# EAGLE schematic fsr_endstop_small (EAGLE 6.5.0)
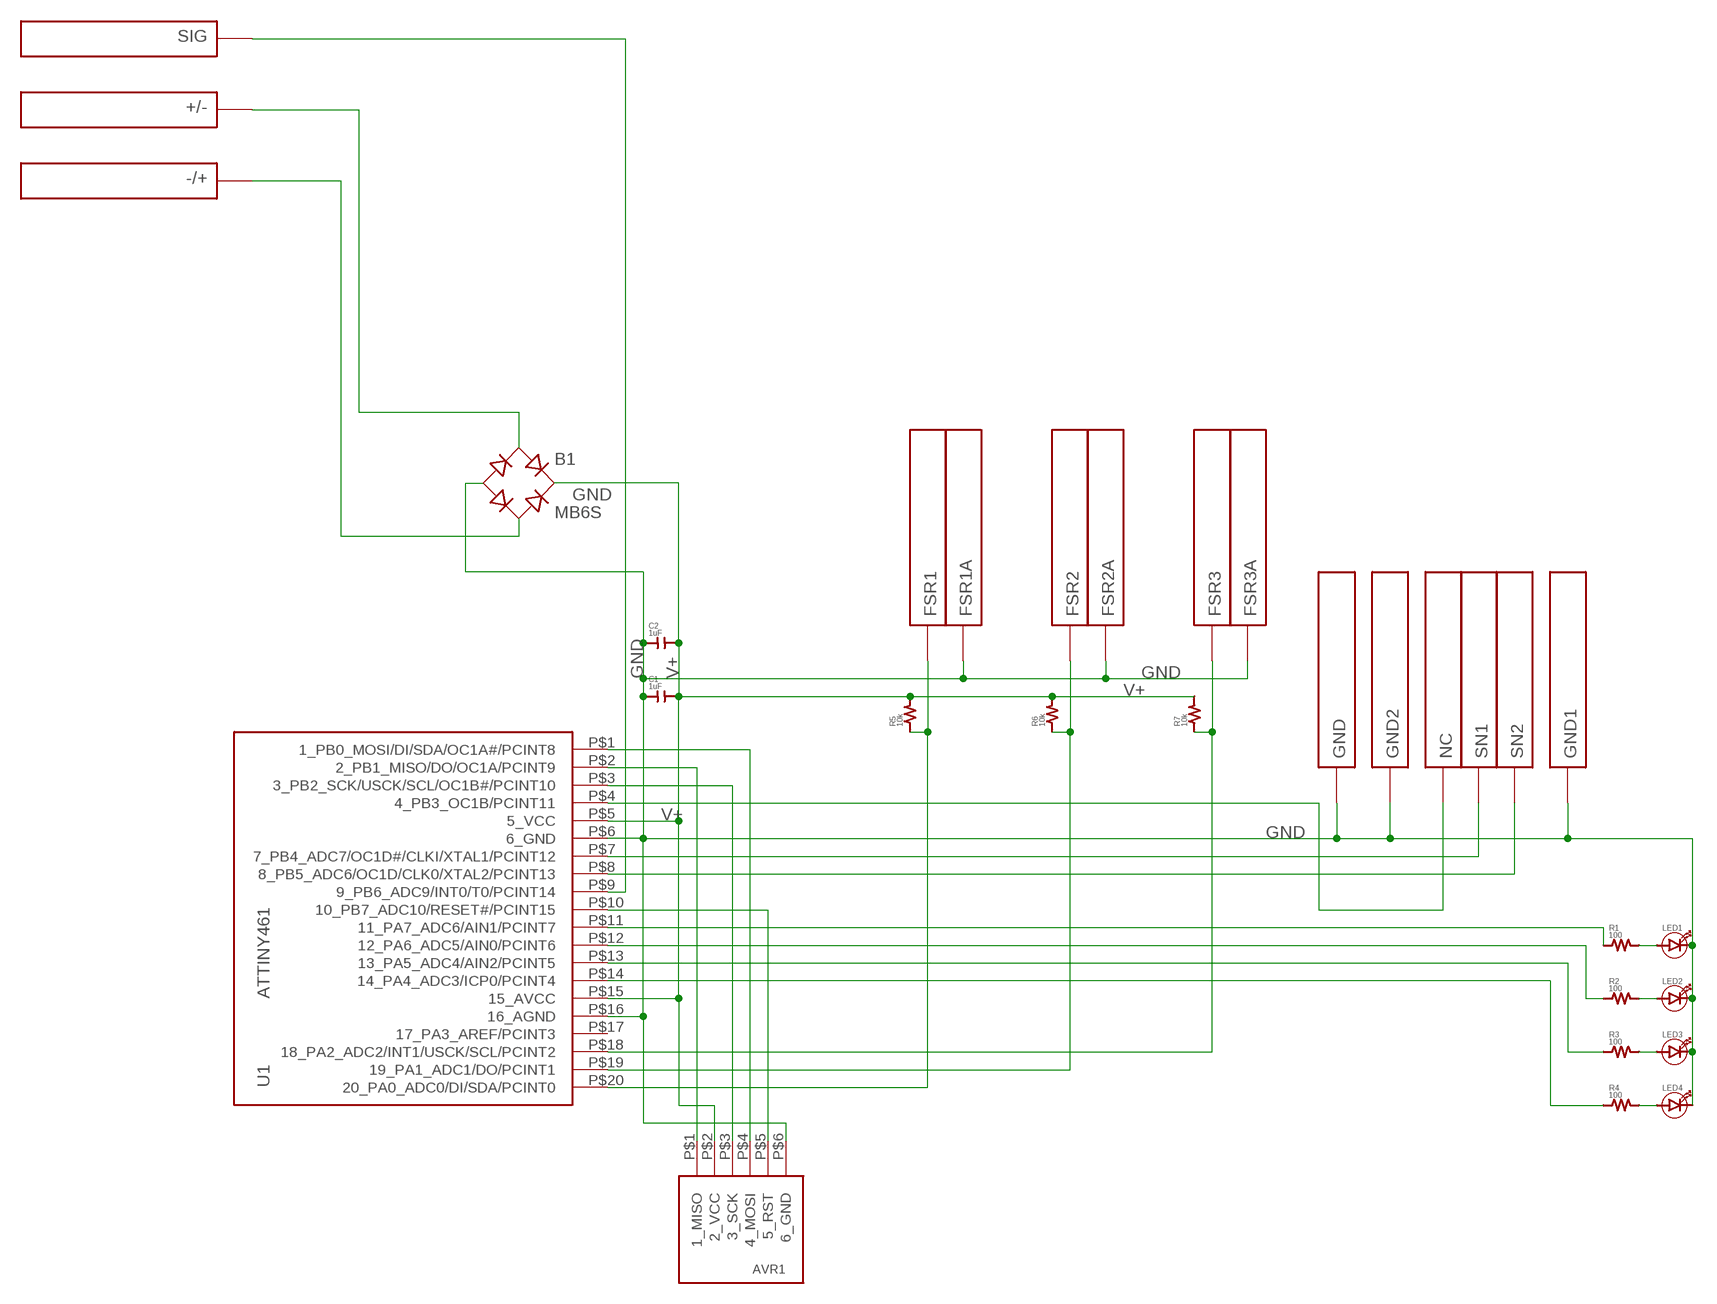
[diagram p0: schematic, sheet 1]

## Parts
+/-  PIN1.2MM  [PIN_1.2MM]
-/+  PIN1.2MM  [PIN_1.2MM]
AVR1  AVR6  [AVR6]
B1  MB6S  [SOIC-4]
C1  1uF  CAP0603  [0603]
C2  1uF  CAP0603  [0603]
FSR1  PIN1.2MM  [PIN_1.2MM]
FSR1A  PIN1.2MM  [PIN_1.2MM]
FSR2  PIN1.2MM  [PIN_1.2MM]
FSR2A  PIN1.2MM  [PIN_1.2MM]
FSR3  PIN1.2MM  [PIN_1.2MM]
FSR3A  PIN1.2MM  [PIN_1.2MM]
GND  PIN1.2MM  [PIN_1.2MM]
GND1  PIN1.2MM  [PIN_1.2MM]
GND2  PIN1.2MM  [PIN_1.2MM]
LED1  LED0603  [0603_DIODE]
LED2  LED0603  [0603_DIODE]
LED3  LED0603  [0603_DIODE]
LED4  LED0603  [0603_DIODE]
NC  PIN1.2MM  [PIN_1.2MM]
R1  100  RES0603  [0603]
R2  100  RES0603  [0603]
R3  100  RES0603  [0603]
R4  100  RES0603  [0603]
R5  10k  RES0603  [0603]
R6  10k  RES0603  [0603]
R7  10k  RES0603  [0603]
SIG  PIN1.2MM  [PIN_1.2MM]
SN1  PIN1.2MM  [PIN_1.2MM]
SN2  PIN1.2MM  [PIN_1.2MM]
U1  ATTINY461  [SOIC-20]

## Nets
GND: AVR1.P$6(6_GND) B1.- C1.1 C2.1 FSR1A.P$1 FSR2A.P$1 FSR3A.P$1 GND1.P$1 GND2.P$1 GND.P$1 LED1.- LED2.- LED3.- LED4.- U1.P$6(6_GND) U1.P$16(16_AGND)
N$1: AVR1.P$4(4_MOSI) U1.P$1(1_PB0_MOSI/DI/SDA/OC1A#/PCINT8)
N$2: AVR1.P$1(1_MISO) U1.P$2(2_PB1_MISO/DO/OC1A/PCINT9)
N$3: -/+.P$1 B1.~2(AC2)
N$4: +/-.P$1 B1.~1(AC1)
N$5: AVR1.P$3(3_SCK) U1.P$3(3_PB2_SCK/USCK/SCL/OC1B#/PCINT10)
N$6: AVR1.P$5(5_RST) U1.P$10(10_PB7_ADC10/RESET#/PCINT15)
N$7: FSR1.P$1 R5.1 U1.P$20(20_PA0_ADC0/DI/SDA/PCINT0)
N$8: FSR2.P$1 R6.1 U1.P$19(19_PA1_ADC1/DO/PCINT1)
N$9: FSR3.P$1 R7.1 U1.P$18(18_PA2_ADC2/INT1/USCK/SCL/PCINT2)
N$10: R4.1 U1.P$14(14_PA4_ADC3/ICP0/PCINT4)
N$11: R3.1 U1.P$13(13_PA5_ADC4/AIN2/PCINT5)
N$12: R2.1 U1.P$12(12_PA6_ADC5/AIN0/PCINT6)
N$13: R1.1 U1.P$11(11_PA7_ADC6/AIN1/PCINT7)
N$14: SIG.P$1 U1.P$9(9_PB6_ADC9/INT0/T0/PCINT14)
N$15: NC.P$1 U1.P$4(4_PB3_OC1B/PCINT11)
N$16: SN2.P$1 U1.P$8(8_PB5_ADC6/OC1D/CLK0/XTAL2/PCINT13)
N$17: SN1.P$1 U1.P$7(7_PB4_ADC7/OC1D#/CLKI/XTAL1/PCINT12)
N$18: LED1.+ R1.2
N$19: LED2.+ R2.2
N$20: LED3.+ R3.2
N$21: LED4.+ R4.2
V+: AVR1.P$2(2_VCC) B1.+ C1.2 C2.2 R5.2 R6.2 R7.2 U1.P$5(5_VCC) U1.P$15(15_AVCC)
Unconnected: U1.P$17(17_PA3_AREF/PCINT3)

## Library data of the parts
+/- -/+ FSR1 FSR1A FSR2 FSR2A FSR3 FSR3A GND GND1 GND2 NC SIG SN1 SN2 = _sg_lib:PIN
AVR1 = _sg_misc:AVR6
B1 = rectifier:MB*S: Bridge Rectifier Source: http://www.fairchildsemi.com/ds/MB/MB6S.pdf
C1 C2 = _sg_lib:CAP0603
LED1-LED4 = _sg_lib:LED0603
R1-R7 = _sg_lib:RES0603
U1 = _sg_misc:ATTINY461